# EAGLE design USB-C-Breakout (EAGLE 9.2.1)
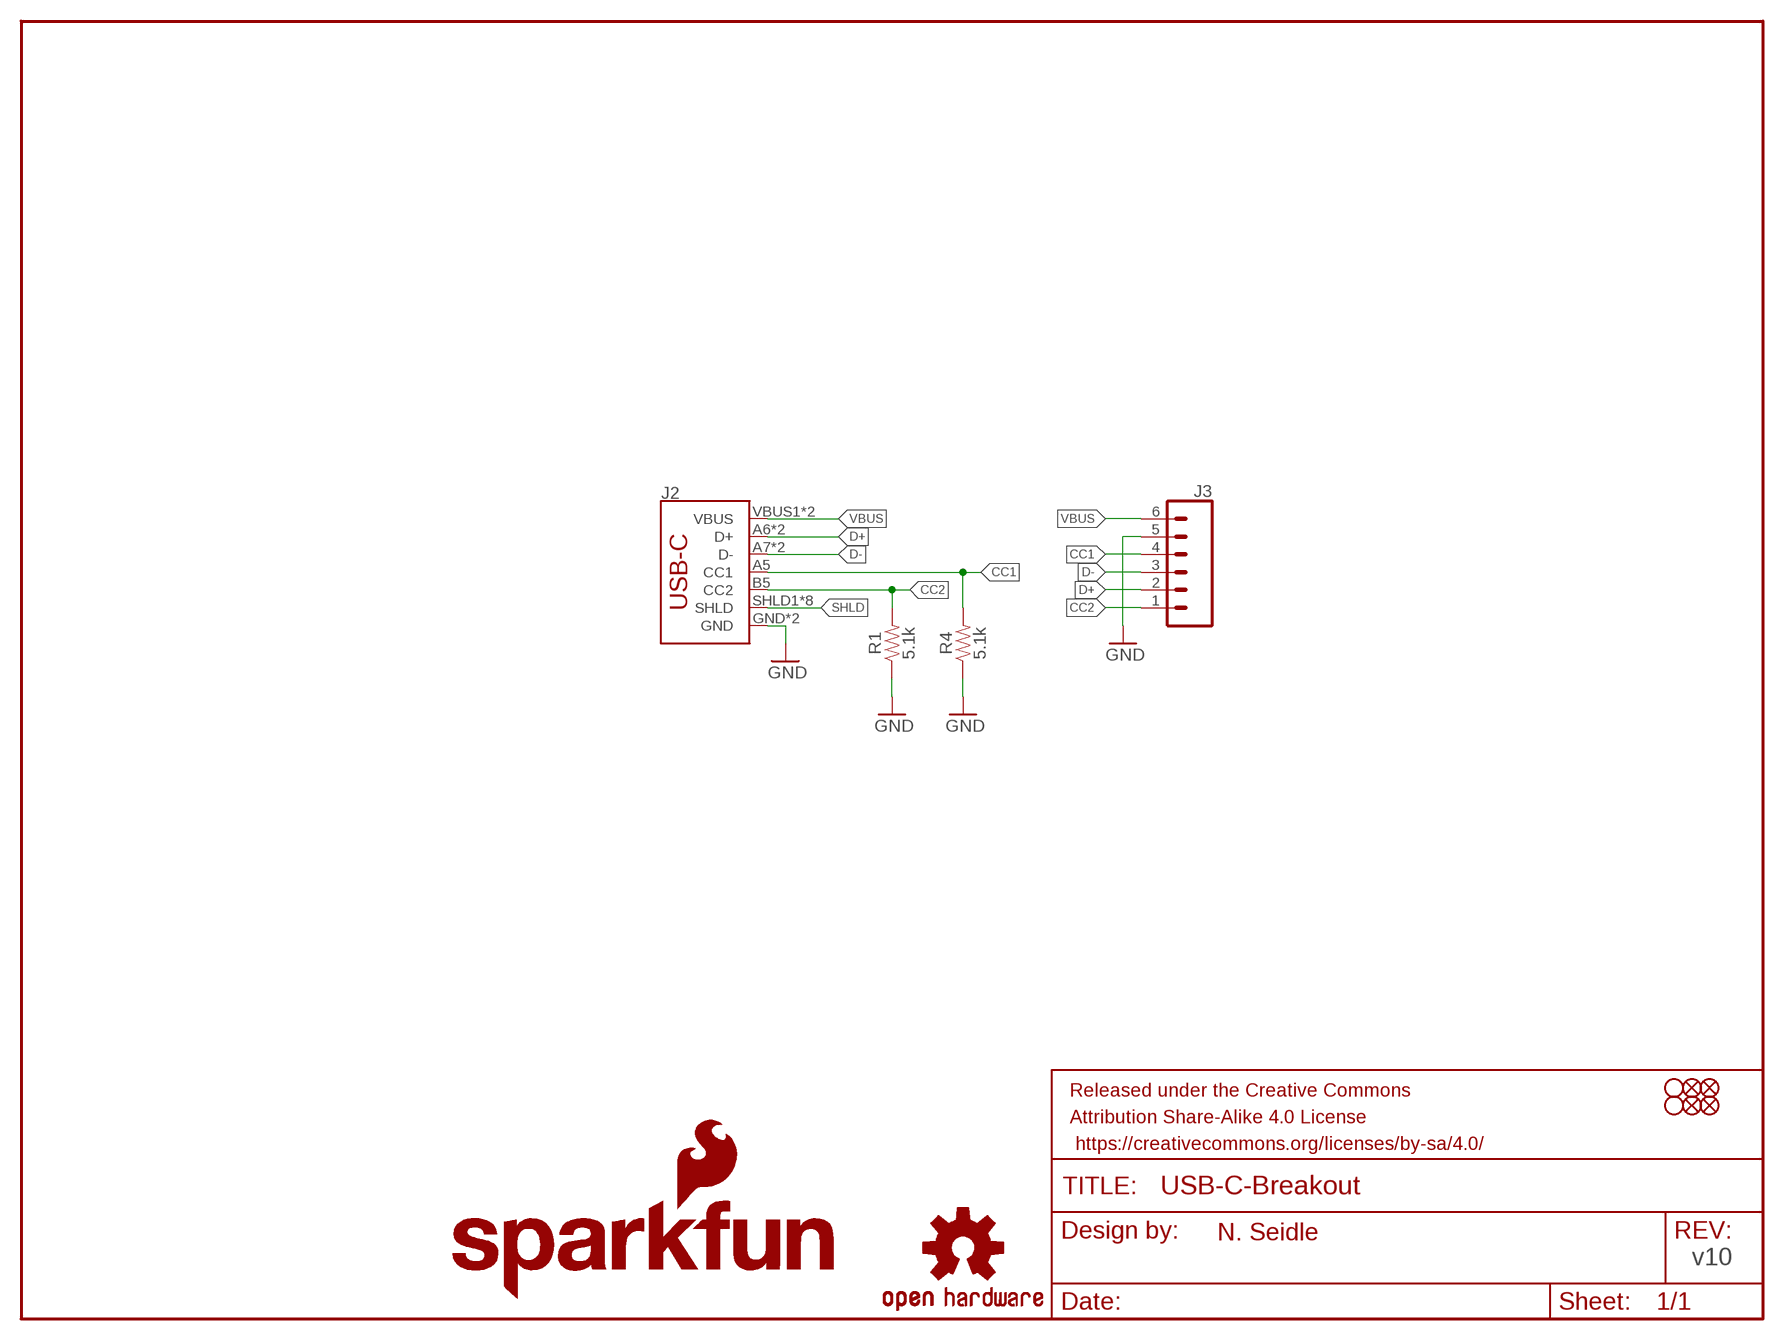
[diagram p0: schematic, sheet 1]

## Parts
FRAME1  FRAME-LETTER  [CREATIVE_COMMONS]
H1  STAND-OFF  [STAND-OFF]
H2  STAND-OFF  [STAND-OFF]
J2  USB_C16PIN  [USB-C-16P]
J3  CONN_06NO_SILK_NO_POP  [1X06_NO_SILK]
JP3  FIDUCIAL1X2  [FIDUCIAL-1X2]
JP4  FIDUCIAL1X2  [FIDUCIAL-1X2]
JP5  FIDUCIAL1X2  [FIDUCIAL-1X2]
JP6  FIDUCIAL1X2  [FIDUCIAL-1X2]
LOGO1  OSHW-LOGOS  [OSHW-LOGO-S]
LOGO2  SFE_LOGO_FLAME.1_INCH  [SFE_LOGO_FLAME_.1]
LOGO4  SFE_LOGO_NAME_FLAME.1_INCH  [SFE_LOGO_NAME_FLAME_.1]
R1  5.1k  5.1KOHM5.1KOHM-0603-1/10W-1%  [0603]
R4  5.1k  5.1KOHM5.1KOHM-0603-1/10W-1%  [0603]

## Nets
CC1: J2.A5(CC1) J3.4 R4.2
CC2: J2.B5(CC2) J3.1 R1.2
D+: J2.A6(D+) J2.B6(D+) J3.2
D-: J2.A7(D-) J2.B7(D-) J3.3
GND [power]: J2.GND J2.GND2(GND) J3.5 R1.1 R4.1
SHLD: J2.SHLD1(SHLD) J2.SHLD2(SHLD) J2.SHLD3(SHLD) J2.SHLD4(SHLD) J2.SHLD5(SHLD) J2.SHLD6(SHLD) J2.SHLD7(SHLD) J2.SHLD8(SHLD)
VBUS: J2.VBUS1(VBUS) J2.VBUS2(VBUS) J3.6

## Notes on the sheet
- N. Seidle
- v10

## Library data of the parts
FRAME1 = SparkFun-Aesthetics:FRAME-LETTER: Schematic Frame - Letter Standard 8.5x11 US Letter frame
H1 H2 = SparkFun-Hardware:STAND-OFF: Stand Off Drill holes for mechanically mounting via screws, standoffs, etc. Note: Use the keepout ring to avoid running the screw head into surrounding components. Variant Overviews STAND-OFF - Mechanical footprint for a #4 phillips button head screw. STAND-OFF-TIGHT - Mechanical footprint for a #4 phillips button head screw, Example SparkFun Products Screw - Phillips Head (1/4", 4-40, 10 pack) <https://www.sparkfun.com/products/10453> (PRT-10453) Screw - Phillips Head (1/2", 4-40, 10 pack) <https://www.sparkfun.com/products/10452> (PRT-10452) Screw - Phillips Head (3/4", 4-40, 10 pack) <https://www.sparkfun.com/products/10451> (PRT-10451) Screw - Phillips Head (1", 4-40, 10 pack) <https://www.sparkfun.com/products/10450> (PRT-10450)
J2 = USB-C:USB_C: USB Type C 16Pin Connector
J3 = SparkFun-Connectors:CONN_06: Multi connection point. Often used as Generic Header-pin footprint for 0.1 inch spaced/style header connections On any of the 0.1 inch spaced packages, you can populate with these: Break Away Headers - Straight <https://www.sparkfun.com/products/116> (PRT-00116) Break Away Male Headers - Right Angle <https://www.sparkfun.com/products/553> (PRT-00553) Female Headers <https://www.sparkfun.com/products/115> (PRT-00115) Break Away Headers - Machine Pin <https://www.sparkfun.com/products/117> (PRT-00117) Break Away Female Headers - Swiss Machine Pin <https://www.sparkfun.com/products/743> (PRT-00743) Arduino Stackable Header - 6 Pin <https://www.sparkfun.com/products/9280> (PRT-09280) For SCREWTERMINALS and SPRING TERMINALS visit here: Screw Terimnals on SparkFun.com <https://www.sparkfun.com/search/results?term=Screw+Terminals> (5mm/3.5mm/2.54mm spacing) This device is also useful as a general connection point to wire up your design to another part of your project. Our various solder wires solder well into these plated through hole pads. Hook-Up Wire - Assortment (Stranded, 22 AWG) <https://www.sparkfun.com/products/11375> (PRT-11375) Hook-Up Wire - Assortment (Solid Core, 22 AWG) <https://www.sparkfun.com/products/11367> (PRT-11367) View the entire wire category on our website here <https://www.sparkfun.com/categories/141>
JP3-JP6 = SparkFun:FIDUCIAL: Fiducial Alignment Points Various fiducial points for machine vision alignment.
LOGO1 = SparkFun-Aesthetics:OSHW-LOGO: Open-Source Hardware (OSHW) Logo This logo indicates the piece of hardware it is found on incorporates a OSHW license and/or adheres to the definition of open source hardware found here: http://freedomdefined.org/OSHW
LOGO2 = SparkFun-Aesthetics:SFE_LOGO_FLAME: SparkFun Flame Logo This is the SparkFun flame logo. The logo on the schematic will always be the same size; the package variant is the height of the flame. Default layer for the logo on the board is tSilk.
LOGO4 = SparkFun-Aesthetics:SFE_LOGO_NAME_FLAME: SparkFun Font Logo w/ Flame This is the SparkFun full logo. The logo on the schematic will always be the same size; the package variant is the height of the flame part of the logo. Default layer for the logo on the board is tSilk.
R1 R4 = SparkFun-Resistors:5.1KOHM; PROD_ID: RES-12083

## Net classes
1 power: width 0.178 mm

## Board
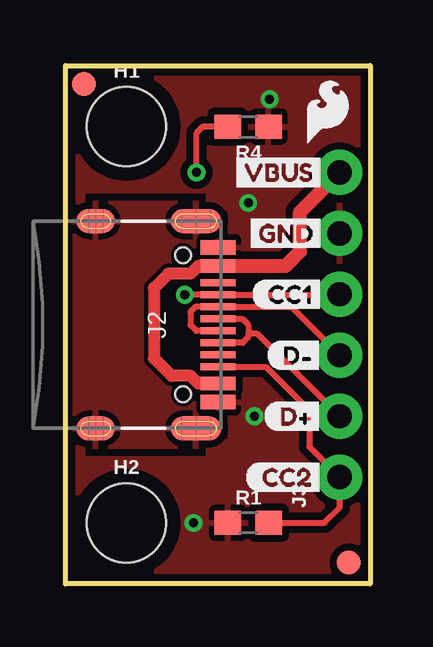
[diagram p1: board, top side]
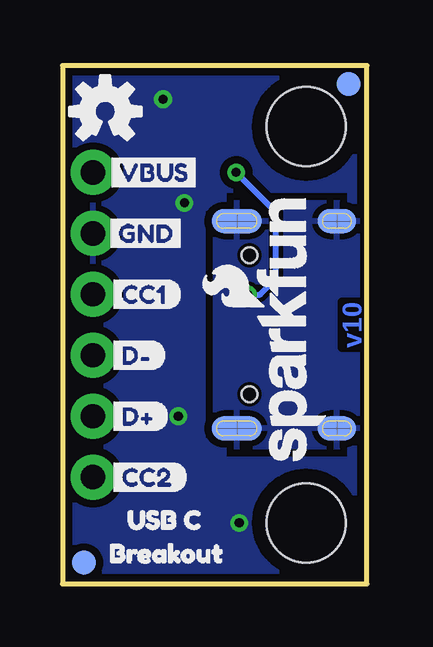
[diagram p2: board, bottom side, seen from below]

Size 12.7 x 21.59 mm. Coordinates in mm from the lower left corner, seen from the top.
Outline: 12.7,0 0,0 0,21.59 12.7,21.59 12.7,0
Copper layers (1*16): Top 0.035mm / dielectric 1.5mm / Bottom 0.035mm
Design rules "SparkFun-2-layer-TIGHT": minimum track width 7mil, minimum drill 15mil, track to track 7mil, track to pad 7mil, pad to pad 7mil, via to via 7mil, smd to smd 7mil, copper to edge 7mil, drill to drill 7mil, minimum pad ring 7mil, minimum via ring 7mil, stop-mask expansion 4mil, vias tented up to drill 25mil, thermal gap 10mil

### Footprints (pad centres in the part's own frame; a part is rotated, then mirrored left to right if it is on the bottom)
STAND-OFF = hole 3.302: 0,0
USB-C-16P = smd 0.3 x 1.45: A5 -1.25,0; A6 -0.25,0; A7 0.25,0; A8 1.25,0; B5 1.75,0; B6 0.75,0; B7 -0.75,0; B8 -1.75,0 | smd 0.6 x 1.45: GND -3.225,0; GND2 3.225,0 | smd 1 x 2.1: SHLD1 -4.32,-0.915; SHLD2 4.32,-0.915 | smd 1 x 2.1 bottom: SHLD3 -4.32,-0.915; SHLD4 4.32,-0.915 | smd 1 x 1.6: SHLD5 -4.32,-5.095; SHLD8 4.32,-5.095 | smd 1 x 1.6 bottom: SHLD6 -4.32,-5.095; SHLD7 4.32,-5.095 | smd 0.55 x 1.45: VBUS1 -2.45,0; VBUS2 2.45,0 | hole 0.65: -2.89,-1.445; 2.89,-1.445
1X06_NO_SILK = drill 1.016 pad 1.88: 1 0,0; 2 2.54,0; 3 5.08,0; 4 7.62,0; 5 10.16,0; 6 12.7,0
FIDUCIAL-1X2 = smd 1 x 1: 1 0,0
0603 = smd 1.1 x 1: 1 -0.85,0; 2 0.85,0

### Placement (x,y rotation side)
FRAME1  -8.31,-17.78 0 top  (outside the outline)
H1  2.54,19.05 0 top
H2  2.54,2.54 0 top
J2  6.35,10.79 270 top
J3  11.43,4.45 90 top
JP3  0.76,20.83 180 top
JP4  11.81,0.89 180 top
JP5  0.76,20.83 180 bottom
JP6  11.81,0.89 180 bottom
LOGO1  10.92,19.68 0 bottom
LOGO2  10.92,19.68 0 top
LOGO4  3.17,10.67 90 bottom
R1  7.62,2.54 0 top
R4  7.62,19.05 180 top
U$1  [GND2]  11.05,14.61 0 bottom
U$2  [BREAKOUT1]  11.43,1.27 0 bottom
U$3  [CC10]  7.75,12.06 0 top
U$4  [CC14]  10.92,12.06 0 bottom
U$5  [CC21]  7.49,4.45 0 top
U$6  [CC25]  10.92,4.45 0 bottom
U$7  [D#6]  10.92,9.53 0 bottom
U$8  [D#7]  10.92,6.99 0 bottom
U$9  [D#8]  8.38,9.53 0 top
U$10  [D#9]  8.26,6.99 0 top
U$11  [GND2]  7.37,14.61 0 top
U$12  [VBUS3]  6.73,17.14 0 top
U$13  [VBUS3]  11.05,17.14 0 bottom
U$14  [USB_C0]  10.67,2.67 0 bottom

### Tracks (layer width: path | path; a pad name or v marks a point on that pad's centre or on a via)
CC1  (via drill 0.38)
  Top 0.254: R4.2 5.71,19.05 5.46,18.8 v5.46,17.14 | J3.4 11.41,12.04 J2.A5 v4.97,12.04 v4.97,12.05
  Bottom 0.254: v4.97,12.05 4.46,12.05 3.81,12.7 3.81,15.49 v5.46,17.14
CC2
  Top 0.254: R1.2 10.79,2.54 11.43,3.17 J3.1 10.16,5.71 10.16,7.24 8.35,9.04 J2.B5
D+
  Top 0.254: J2.A6 7.37,11.04 7.62,10.79 7.62,10.41 | 7.62,10.41 7.62,10.29 7.38,10.04 J2.B6 | J3.2 8,10.41 7.62,10.41
D-
  Top 0.254: J2.A7 5.46,10.54 5.21,10.79 5.21,11.34 5.42,11.54 J2.B7 9.41,11.54 J3.3
GND  (via drill 0.38)
  other vias: 8.51,20.19 7.62,15.88 7.87,6.99 5.33,2.54
  pour Top (isolate 0.305, rank 3): 0,21.59 12.7,21.59 12.7,0 0,0
  pour Bottom (isolate 0.305, rank 3): 0,21.59 12.7,21.59 12.7,0 0,0
SHLD
  pour Bottom: 0,15.88 6.35,15.88 6.35,5.71 0,5.71
  pour Top: 0,15.88 6.35,15.88 6.35,5.71 0,5.71
VBUS
  Top 0.508: J2.VBUS2 5.54,8.35 5.22,8.66 4.42,8.66 3.68,9.4 3.68,12.32 4.29,12.93 5.22,12.93 5.54,13.24 J2.VBUS1
  Top 0.584: J3.6 9.78,15.49 9.78,13.84 9.18,13.24 J2.VBUS1

### Text on the board
Bottom: v10
tValues: Close
Measures: All dimensions in inches
tDocu: Nathan Seidle